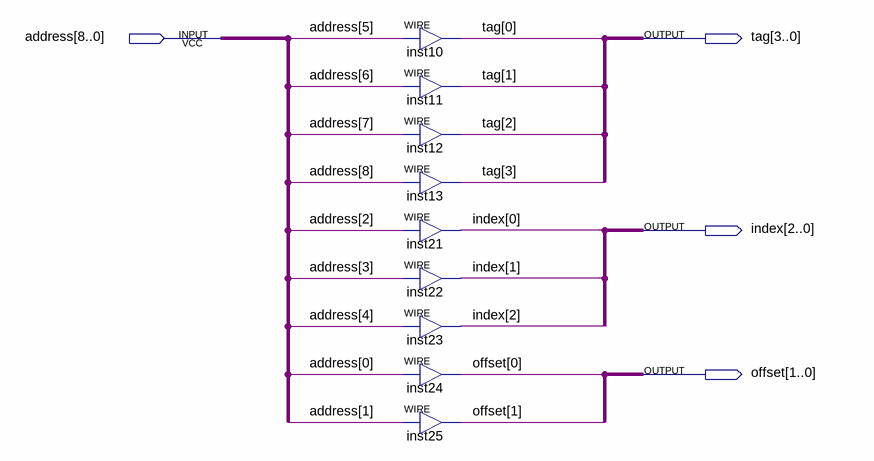
[diagram p0: schematic sheet]
// Quartus schematic address_splitter.bdf as structural Verilog: 9 symbols, 4 pins
module address_splitter (
  input  [8:0] address,
  output [3:0] tag,
  output [2:0] index,
  output [1:0] offset
);

  assign tag[0] = address[5];  // WIRE inst10
  assign tag[1] = address[6];  // WIRE inst11
  assign tag[2] = address[7];  // WIRE inst12
  assign tag[3] = address[8];  // WIRE inst13
  assign index[0] = address[2];  // WIRE inst21
  assign index[1] = address[3];  // WIRE inst22
  assign index[2] = address[4];  // WIRE inst23
  assign offset[0] = address[0];  // WIRE inst24
  assign offset[1] = address[1];  // WIRE inst25
endmodule
